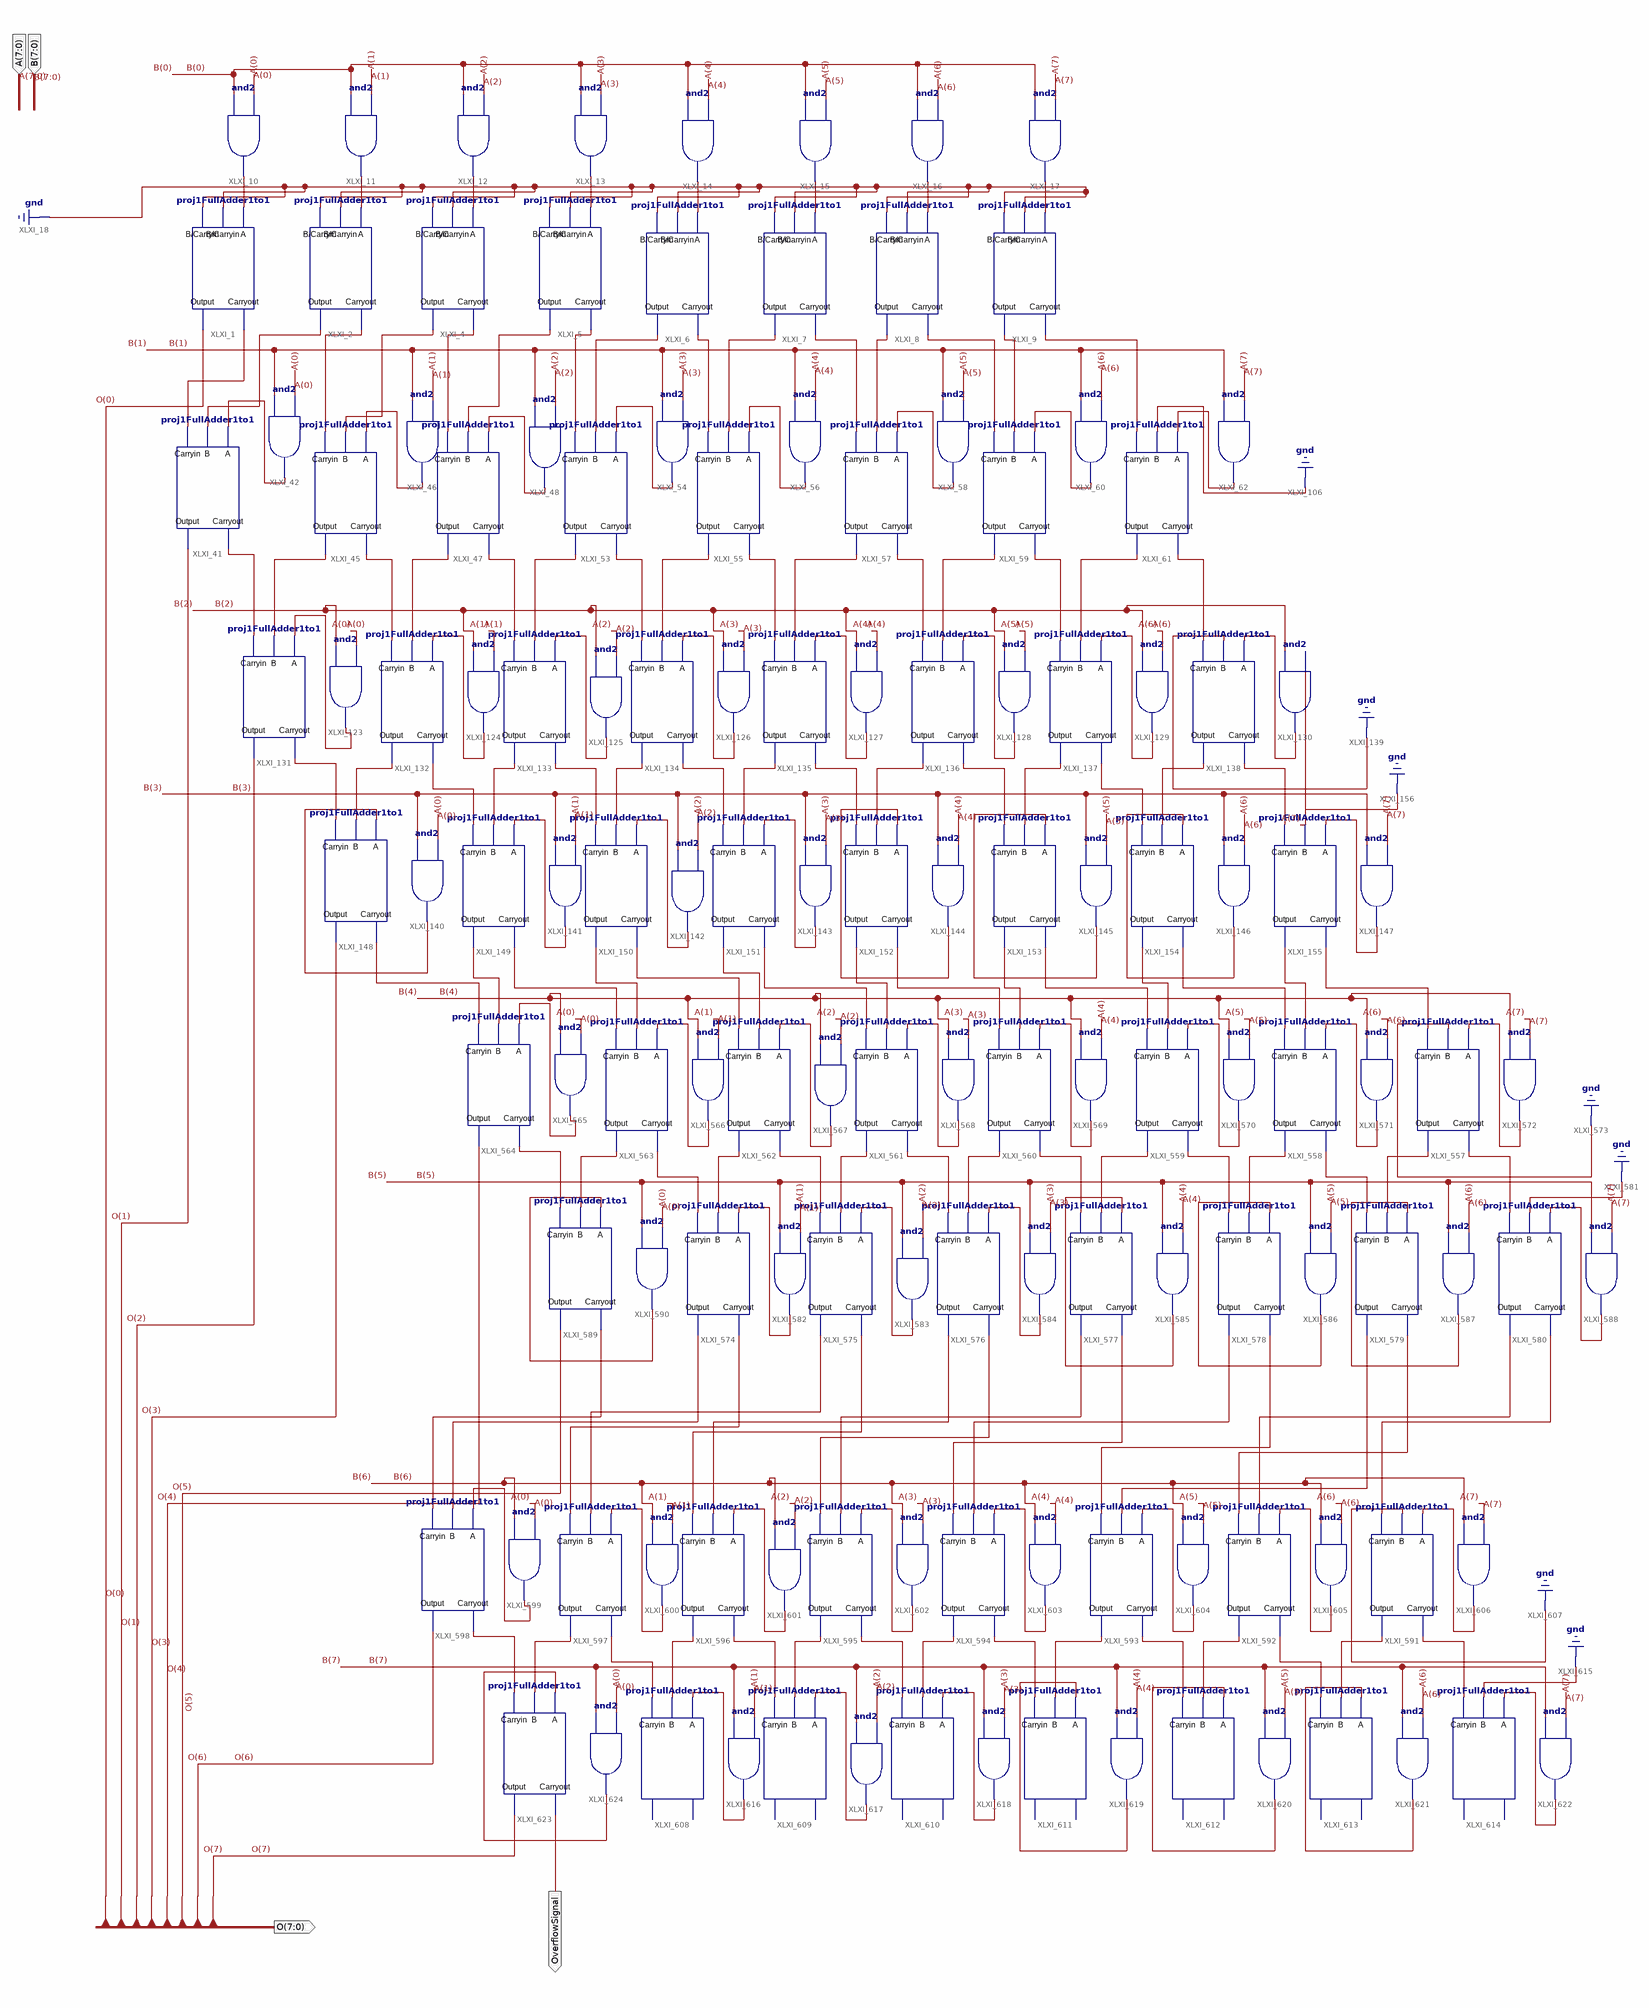
[diagram p0: schematic sheet 1]
// Xilinx ISE schematic proj1multiplier8to8.sch (spartan6) as structural Verilog: 128 symbols, 4 ports
module proj1multiplier8to8 (
  input  [7:0] A,
  input  [7:0] B,
  output [7:0] O,
  output OverflowSignal
);

  wire XLXN_3, XLXN_4, XLXN_5, XLXN_6, XLXN_7, XLXN_8, XLXN_9, XLXN_10, XLXN_95, XLXN_97, XLXN_118, XLXN_119,
       XLXN_122, XLXN_123, XLXN_124, XLXN_125, XLXN_126, XLXN_200, XLXN_201, XLXN_203, XLXN_204, XLXN_205,
       XLXN_206, XLXN_207, XLXN_215, XLXN_216, XLXN_217, XLXN_218, XLXN_219, XLXN_220, XLXN_221, XLXN_254,
       XLXN_256, XLXN_257, XLXN_258, XLXN_259, XLXN_260, XLXN_261, XLXN_262, XLXN_267, XLXN_268, XLXN_272,
       XLXN_273, XLXN_274, XLXN_275, XLXN_276, XLXN_278, XLXN_279, XLXN_280, XLXN_281, XLXN_283, XLXN_284,
       XLXN_287, XLXN_297, XLXN_298, XLXN_299, XLXN_300, XLXN_301, XLXN_302, XLXN_303, XLXN_304, XLXN_305,
       XLXN_310, XLXN_315, XLXN_316, XLXN_317, XLXN_318, XLXN_319, XLXN_356, XLXN_358, XLXN_359, XLXN_360,
       XLXN_361, XLXN_362, XLXN_883, XLXN_1073, XLXN_1074, XLXN_1075, XLXN_1080, XLXN_1081, XLXN_1082,
       XLXN_1083, XLXN_1084, XLXN_1085, XLXN_1086, XLXN_1095, XLXN_1096, XLXN_1097, XLXN_1098, XLXN_1099,
       XLXN_1100, XLXN_1101, XLXN_1102, XLXN_1103, XLXN_1104, XLXN_1105, XLXN_1106, XLXN_1114, XLXN_1115,
       XLXN_1116, XLXN_1117, XLXN_1118, XLXN_1121, XLXN_1122, XLXN_1125, XLXN_1126, XLXN_1127, XLXN_1132,
       XLXN_1133, XLXN_1134, XLXN_1135, XLXN_1136, XLXN_1137, XLXN_1138, XLXN_1148, XLXN_1149, XLXN_1150,
       XLXN_1151, XLXN_1152, XLXN_1153, XLXN_1154, XLXN_1155, XLXN_1156, XLXN_1157, XLXN_1158, XLXN_1159,
       XLXN_1167, XLXN_1168, XLXN_1169, XLXN_1170, XLXN_1171, XLXN_1175, XLXN_1184, XLXN_1185, XLXN_1188,
       XLXN_1189, XLXN_1192, XLXN_1193, XLXN_1194, XLXN_1195, XLXN_1196, XLXN_1197, XLXN_1198, XLXN_1199,
       XLXN_1200, XLXN_1201, XLXN_1202, XLXN_1203, XLXN_1204, XLXN_1205, XLXN_1206, XLXN_1211, XLXN_1212,
       XLXN_1213, XLXN_1218, XLXN_1219, XLXN_1220, XLXN_1221, XLXN_1222, XLXN_1223, XLXN_1224, XLXN_1225,
       XLXN_1226, XLXN_1227, XLXN_1228, XLXN_1229, XLXN_1236, XLXN_1237, XLXN_1239;

  proj1FullAdder1to1 XLXI_1 (.A(XLXN_3), .B(1'b0), .Carryin(1'b0), .Carryout(XLXN_97), .Output(O[0]));
  proj1FullAdder1to1 XLXI_2 (.A(XLXN_4), .B(1'b0), .Carryin(1'b0), .Carryout(XLXN_200), .Output(XLXN_215));
  proj1FullAdder1to1 XLXI_4 (.A(XLXN_5), .B(1'b0), .Carryin(1'b0), .Carryout(XLXN_201), .Output(XLXN_216));
  proj1FullAdder1to1 XLXI_5 (.A(XLXN_6), .B(1'b0), .Carryin(1'b0), .Carryout(XLXN_203), .Output(XLXN_217));
  proj1FullAdder1to1 XLXI_6 (.A(XLXN_7), .B(1'b0), .Carryin(1'b0), .Carryout(XLXN_204), .Output(XLXN_218));
  proj1FullAdder1to1 XLXI_7 (.A(XLXN_8), .B(1'b0), .Carryin(1'b0), .Carryout(XLXN_205), .Output(XLXN_219));
  proj1FullAdder1to1 XLXI_8 (.A(XLXN_9), .B(1'b0), .Carryin(1'b0), .Carryout(XLXN_206), .Output(XLXN_220));
  proj1FullAdder1to1 XLXI_9 (.A(XLXN_10), .B(1'b0), .Carryin(1'b0), .Carryout(XLXN_207), .Output(XLXN_221));
  and XLXI_10 (XLXN_3, B[0], A[0]);
  and XLXI_11 (XLXN_4, B[0], A[1]);
  and XLXI_12 (XLXN_5, B[0], A[2]);
  and XLXI_13 (XLXN_6, B[0], A[3]);
  and XLXI_14 (XLXN_7, B[0], A[4]);
  and XLXI_15 (XLXN_8, B[0], A[5]);
  and XLXI_16 (XLXN_9, B[0], A[6]);
  and XLXI_17 (XLXN_10, B[0], A[7]);
  and XLXI_42 (XLXN_95, B[1], A[0]);
  and XLXI_46 (XLXN_118, B[1], A[1]);
  and XLXI_48 (XLXN_119, B[1], A[2]);
  and XLXI_54 (XLXN_122, B[1], A[3]);
  and XLXI_56 (XLXN_123, B[1], A[4]);
  and XLXI_58 (XLXN_124, B[1], A[5]);
  and XLXI_60 (XLXN_125, B[1], A[6]);
  and XLXI_62 (XLXN_126, B[1], A[7]);
  proj1FullAdder1to1 XLXI_41 (.A(XLXN_95), .B(XLXN_215), .Carryin(XLXN_97), .Carryout(XLXN_254), .Output(O[1]));
  proj1FullAdder1to1 XLXI_45 (.A(XLXN_118), .B(XLXN_216), .Carryin(XLXN_200), .Carryout(XLXN_279), .Output(XLXN_278));
  proj1FullAdder1to1 XLXI_47 (.A(XLXN_119), .B(XLXN_217), .Carryin(XLXN_201), .Carryout(XLXN_281), .Output(XLXN_280));
  proj1FullAdder1to1 XLXI_53 (.A(XLXN_122), .B(XLXN_218), .Carryin(XLXN_203), .Carryout(XLXN_283), .Output(XLXN_272));
  proj1FullAdder1to1 XLXI_55 (.A(XLXN_123), .B(XLXN_219), .Carryin(XLXN_204), .Carryout(XLXN_284), .Output(XLXN_273));
  proj1FullAdder1to1 XLXI_57 (.A(XLXN_124), .B(XLXN_220), .Carryin(XLXN_205), .Carryout(XLXN_267), .Output(XLXN_274));
  proj1FullAdder1to1 XLXI_59 (.A(XLXN_125), .B(XLXN_221), .Carryin(XLXN_206), .Carryout(XLXN_268), .Output(XLXN_275));
  proj1FullAdder1to1 XLXI_61 (.A(XLXN_126), .B(1'b0), .Carryin(XLXN_207), .Carryout(XLXN_287), .Output(XLXN_276));
  proj1FullAdder1to1 XLXI_138 (.A(XLXN_262), .B(1'b0), .Carryin(XLXN_287), .Carryout(XLXN_362), .Output(XLXN_319));
  proj1FullAdder1to1 XLXI_137 (.A(XLXN_261), .B(XLXN_276), .Carryin(XLXN_268), .Carryout(XLXN_1189), .Output(XLXN_318));
  proj1FullAdder1to1 XLXI_136 (.A(XLXN_260), .B(XLXN_275), .Carryin(XLXN_267), .Carryout(XLXN_310), .Output(XLXN_317));
  proj1FullAdder1to1 XLXI_135 (.A(XLXN_259), .B(XLXN_274), .Carryin(XLXN_284), .Carryout(XLXN_361), .Output(XLXN_316));
  proj1FullAdder1to1 XLXI_134 (.A(XLXN_258), .B(XLXN_273), .Carryin(XLXN_283), .Carryout(XLXN_360), .Output(XLXN_315));
  proj1FullAdder1to1 XLXI_133 (.A(XLXN_257), .B(XLXN_272), .Carryin(XLXN_281), .Carryout(XLXN_359), .Output(XLXN_358));
  proj1FullAdder1to1 XLXI_132 (.A(XLXN_256), .B(XLXN_280), .Carryin(XLXN_279), .Carryout(XLXN_1188), .Output(XLXN_356));
  proj1FullAdder1to1 XLXI_131 (.A(XLXN_883), .B(XLXN_278), .Carryin(XLXN_254), .Carryout(XLXN_297), .Output(O[2]));
  and XLXI_123 (XLXN_883, B[2], A[0]);
  and XLXI_124 (XLXN_256, B[2], A[1]);
  and XLXI_125 (XLXN_257, B[2], A[2]);
  and XLXI_126 (XLXN_258, B[2], A[3]);
  and XLXI_127 (XLXN_259, B[2], A[4]);
  and XLXI_128 (XLXN_260, B[2], A[5]);
  and XLXI_129 (XLXN_261, B[2], A[6]);
  and XLXI_130 (XLXN_262, B[2], A[7]);
  proj1FullAdder1to1 XLXI_149 (
    .A(XLXN_299), .B(XLXN_358), .Carryin(XLXN_1188), .Carryout(XLXN_1194), .Output(XLXN_1193));
  proj1FullAdder1to1 XLXI_150 (
    .A(XLXN_300), .B(XLXN_315), .Carryin(XLXN_359), .Carryout(XLXN_1196), .Output(XLXN_1195));
  proj1FullAdder1to1 XLXI_151 (
    .A(XLXN_301), .B(XLXN_316), .Carryin(XLXN_360), .Carryout(XLXN_1197), .Output(XLXN_1198));
  proj1FullAdder1to1 XLXI_152 (
    .A(XLXN_302), .B(XLXN_317), .Carryin(XLXN_361), .Carryout(XLXN_1200), .Output(XLXN_1199));
  proj1FullAdder1to1 XLXI_153 (
    .A(XLXN_303), .B(XLXN_318), .Carryin(XLXN_310), .Carryout(XLXN_1202), .Output(XLXN_1201));
  proj1FullAdder1to1 XLXI_154 (
    .A(XLXN_304), .B(XLXN_319), .Carryin(XLXN_1189), .Carryout(XLXN_1204), .Output(XLXN_1203));
  proj1FullAdder1to1 XLXI_155 (.A(XLXN_305), .B(1'b0), .Carryin(XLXN_362), .Carryout(XLXN_1206), .Output(XLXN_1205));
  and XLXI_141 (XLXN_299, B[3], A[1]);
  and XLXI_142 (XLXN_300, B[3], A[2]);
  and XLXI_143 (XLXN_301, B[3], A[3]);
  and XLXI_144 (XLXN_302, B[3], A[4]);
  and XLXI_145 (XLXN_303, B[3], A[5]);
  and XLXI_146 (XLXN_304, B[3], A[6]);
  and XLXI_147 (XLXN_305, B[3], A[7]);
  and XLXI_140 (XLXN_298, B[3], A[0]);
  proj1FullAdder1to1 XLXI_148 (.A(XLXN_298), .B(XLXN_356), .Carryin(XLXN_297), .Carryout(XLXN_1192), .Output(O[3]));
  proj1FullAdder1to1 XLXI_557 (.A(XLXN_1086), .B(1'b0), .Carryin(XLXN_1206), .Carryout(XLXN_1118), .Output(XLXN_1099));
  proj1FullAdder1to1 XLXI_558 (
    .A(XLXN_1085), .B(XLXN_1205), .Carryin(XLXN_1204), .Carryout(XLXN_1185), .Output(XLXN_1098));
  proj1FullAdder1to1 XLXI_559 (
    .A(XLXN_1084), .B(XLXN_1203), .Carryin(XLXN_1202), .Carryout(XLXN_1117), .Output(XLXN_1097));
  proj1FullAdder1to1 XLXI_560 (
    .A(XLXN_1083), .B(XLXN_1201), .Carryin(XLXN_1200), .Carryout(XLXN_1116), .Output(XLXN_1075));
  proj1FullAdder1to1 XLXI_561 (
    .A(XLXN_1082), .B(XLXN_1199), .Carryin(XLXN_1197), .Carryout(XLXN_1115), .Output(XLXN_1074));
  proj1FullAdder1to1 XLXI_562 (
    .A(XLXN_1081), .B(XLXN_1198), .Carryin(XLXN_1196), .Carryout(XLXN_1114), .Output(XLXN_1073));
  proj1FullAdder1to1 XLXI_563 (
    .A(XLXN_1080), .B(XLXN_1195), .Carryin(XLXN_1194), .Carryout(XLXN_1184), .Output(XLXN_1096));
  proj1FullAdder1to1 XLXI_564 (.A(XLXN_1095), .B(XLXN_1193), .Carryin(XLXN_1192), .Carryout(XLXN_1122), .Output(O[4]));
  and XLXI_565 (XLXN_1095, B[4], A[0]);
  and XLXI_566 (XLXN_1080, B[4], A[1]);
  and XLXI_567 (XLXN_1081, B[4], A[2]);
  and XLXI_568 (XLXN_1082, B[4], A[3]);
  and XLXI_569 (XLXN_1083, B[4], A[4]);
  and XLXI_570 (XLXN_1084, B[4], A[5]);
  and XLXI_571 (XLXN_1085, B[4], A[6]);
  and XLXI_572 (XLXN_1086, B[4], A[7]);
  proj1FullAdder1to1 XLXI_574 (
    .A(XLXN_1100), .B(XLXN_1073), .Carryin(XLXN_1184), .Carryout(XLXN_1213), .Output(XLXN_1212));
  proj1FullAdder1to1 XLXI_575 (
    .A(XLXN_1101), .B(XLXN_1074), .Carryin(XLXN_1114), .Carryout(XLXN_1218), .Output(XLXN_1224));
  proj1FullAdder1to1 XLXI_576 (
    .A(XLXN_1102), .B(XLXN_1075), .Carryin(XLXN_1115), .Carryout(XLXN_1219), .Output(XLXN_1225));
  proj1FullAdder1to1 XLXI_577 (
    .A(XLXN_1103), .B(XLXN_1097), .Carryin(XLXN_1116), .Carryout(XLXN_1220), .Output(XLXN_1226));
  proj1FullAdder1to1 XLXI_578 (
    .A(XLXN_1104), .B(XLXN_1098), .Carryin(XLXN_1117), .Carryout(XLXN_1221), .Output(XLXN_1227));
  proj1FullAdder1to1 XLXI_579 (
    .A(XLXN_1105), .B(XLXN_1099), .Carryin(XLXN_1185), .Carryout(XLXN_1222), .Output(XLXN_1228));
  proj1FullAdder1to1 XLXI_580 (.A(XLXN_1106), .B(1'b0), .Carryin(XLXN_1118), .Carryout(XLXN_1223), .Output(XLXN_1229));
  and XLXI_582 (XLXN_1100, B[5], A[1]);
  and XLXI_583 (XLXN_1101, B[5], A[2]);
  and XLXI_584 (XLXN_1102, B[5], A[3]);
  and XLXI_585 (XLXN_1103, B[5], A[4]);
  and XLXI_586 (XLXN_1104, B[5], A[5]);
  and XLXI_587 (XLXN_1105, B[5], A[6]);
  and XLXI_588 (XLXN_1106, B[5], A[7]);
  proj1FullAdder1to1 XLXI_589 (.A(XLXN_1121), .B(XLXN_1096), .Carryin(XLXN_1122), .Carryout(XLXN_1211), .Output(O[5]));
  and XLXI_590 (XLXN_1121, B[5], A[0]);
  proj1FullAdder1to1 XLXI_591 (.A(XLXN_1138), .B(1'b0), .Carryin(XLXN_1223), .Carryout(XLXN_1171), .Output(XLXN_1152));
  proj1FullAdder1to1 XLXI_592 (
    .A(XLXN_1137), .B(XLXN_1229), .Carryin(XLXN_1222), .Carryout(XLXN_1237), .Output(XLXN_1151));
  proj1FullAdder1to1 XLXI_593 (
    .A(XLXN_1136), .B(XLXN_1228), .Carryin(XLXN_1221), .Carryout(XLXN_1170), .Output(XLXN_1150));
  proj1FullAdder1to1 XLXI_594 (
    .A(XLXN_1135), .B(XLXN_1227), .Carryin(XLXN_1220), .Carryout(XLXN_1169), .Output(XLXN_1127));
  proj1FullAdder1to1 XLXI_595 (
    .A(XLXN_1134), .B(XLXN_1226), .Carryin(XLXN_1219), .Carryout(XLXN_1168), .Output(XLXN_1126));
  proj1FullAdder1to1 XLXI_596 (
    .A(XLXN_1133), .B(XLXN_1225), .Carryin(XLXN_1218), .Carryout(XLXN_1167), .Output(XLXN_1125));
  proj1FullAdder1to1 XLXI_597 (
    .A(XLXN_1132), .B(XLXN_1224), .Carryin(XLXN_1213), .Carryout(XLXN_1236), .Output(XLXN_1149));
  proj1FullAdder1to1 XLXI_598 (.A(XLXN_1148), .B(XLXN_1212), .Carryin(XLXN_1211), .Carryout(XLXN_1175), .Output(O[6]));
  and XLXI_599 (XLXN_1148, B[6], A[0]);
  and XLXI_600 (XLXN_1132, B[6], A[1]);
  and XLXI_601 (XLXN_1133, B[6], A[2]);
  and XLXI_602 (XLXN_1134, B[6], A[3]);
  and XLXI_603 (XLXN_1135, B[6], A[4]);
  and XLXI_604 (XLXN_1136, B[6], A[5]);
  and XLXI_605 (XLXN_1137, B[6], A[6]);
  and XLXI_606 (XLXN_1138, B[6], A[7]);
  proj1FullAdder1to1 XLXI_608 (.A(XLXN_1153), .B(XLXN_1125), .Carryin(XLXN_1236));  // open: Carryout, Output
  proj1FullAdder1to1 XLXI_609 (.A(XLXN_1154), .B(XLXN_1126), .Carryin(XLXN_1167));  // open: Carryout, Output
  proj1FullAdder1to1 XLXI_610 (.A(XLXN_1155), .B(XLXN_1127), .Carryin(XLXN_1168));  // open: Carryout, Output
  proj1FullAdder1to1 XLXI_611 (.A(XLXN_1156), .B(XLXN_1150), .Carryin(XLXN_1169));  // open: Carryout, Output
  proj1FullAdder1to1 XLXI_612 (.A(XLXN_1157), .B(XLXN_1151), .Carryin(XLXN_1170));  // open: Carryout, Output
  proj1FullAdder1to1 XLXI_613 (.A(XLXN_1158), .B(XLXN_1152), .Carryin(XLXN_1237));  // open: Carryout, Output
  proj1FullAdder1to1 XLXI_614 (.A(XLXN_1159), .B(1'b0), .Carryin(XLXN_1171));  // open: Carryout, Output
  and XLXI_616 (XLXN_1153, B[7], A[1]);
  and XLXI_617 (XLXN_1154, B[7], A[2]);
  and XLXI_618 (XLXN_1155, B[7], A[3]);
  and XLXI_619 (XLXN_1156, B[7], A[4]);
  and XLXI_620 (XLXN_1157, B[7], A[5]);
  and XLXI_621 (XLXN_1158, B[7], A[6]);
  and XLXI_622 (XLXN_1159, B[7], A[7]);
  proj1FullAdder1to1 XLXI_623 (
    .A(XLXN_1239), .B(XLXN_1149), .Carryin(XLXN_1175), .Carryout(OverflowSignal), .Output(O[7]));
  and XLXI_624 (XLXN_1239, B[7], A[0]);
endmodule
